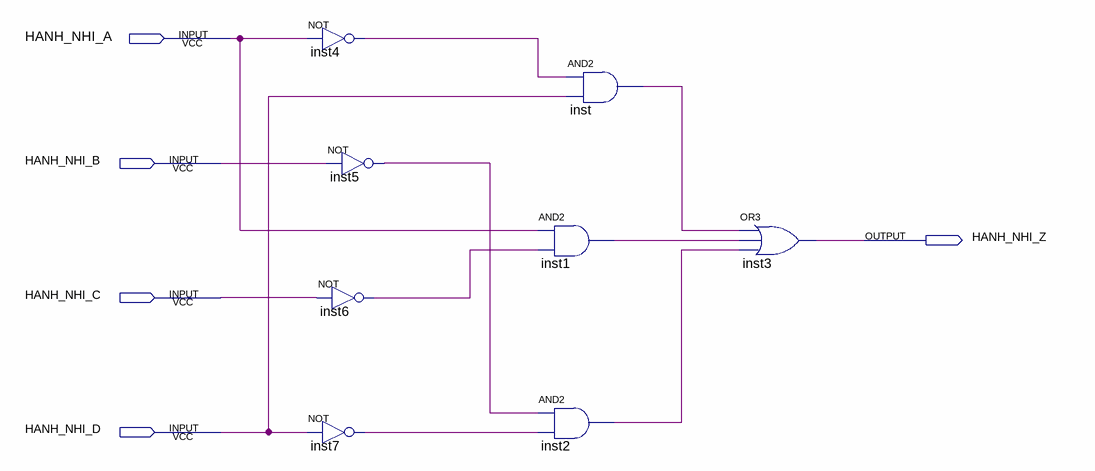
[diagram p0: schematic sheet]
// Quartus schematic Assignment5.bdf as structural Verilog: 8 symbols, 5 pins
module Assignment5 (
  input  HANH_NHI_A,
  input  HANH_NHI_B,
  input  HANH_NHI_C,
  input  HANH_NHI_D,
  output HANH_NHI_Z
);

  wire inst1_out, inst2_out, inst4_out, inst5_out, inst6_out, inst7_out, inst_out;

  not inst4 (inst4_out, HANH_NHI_A);
  not inst5 (inst5_out, HANH_NHI_B);
  not inst6 (inst6_out, HANH_NHI_C);
  not inst7 (inst7_out, HANH_NHI_D);
  and inst (inst_out, inst4_out, HANH_NHI_D);
  and inst1 (inst1_out, HANH_NHI_A, inst6_out);
  and inst2 (inst2_out, inst5_out, inst7_out);
  or inst3 (HANH_NHI_Z, inst_out, inst1_out, inst2_out);
endmodule
